# Altium schematic sheet Sheet1.SchDoc
size A4; SheetNumber: 1; SheetTotal: 1
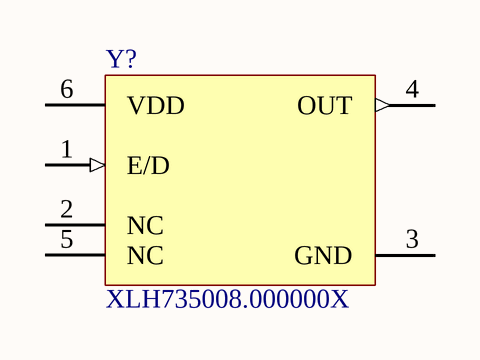
[diagram p0: Sheet1.SchDoc]

## Parts
Y?  XLH735008.000000X  [JU6_MFG]

## Nets

Not connected (* = marked no-connect by the designer): Y? 1(E/D) 2(NC) 3(GND) 4(OUT) 5(NC) 6(VDD)

## Library data of the parts
Y? = CMP-00572-107081545-1: Oscillator, 8Mhz, Hcmos, 7Mm X 5Mm Rohs Compliant: Yes; Min Input Voltage: 3.135V; Output Type: LVCMOS; Max Output Frequency: 9.9MHz; Max Input Voltage: 3.465V; ComponentLink3Description: Manufacturer's Package Drawing; ComponentLink2URL: https://octopart.com/cad-content/api/get-model-datasheet/15189/107081545; Case/Package: CLCC; Min Operating Temperature: -20°C; Height: 1.45mm; ComponentLink1Description: Manufacturer's Website; HelpURL: https://octopart.com/cad-content/api/get-model-datasheet/15189/107081545; ComponentLink2Description: Datasheet URL; ComponentLink3URL: https://www.renesas.com/en/document/psc/ju6-package-outline-70-x-50-mm-body-13-mm-thick; ComponentLink1URL: http://www.renesas.com; Mount: Surface Mount; RoHS: Compliant; Max Operating Temperature: 70°C; Number of Pins: 6